# Altium project TermWylPompy1.PrjPcb
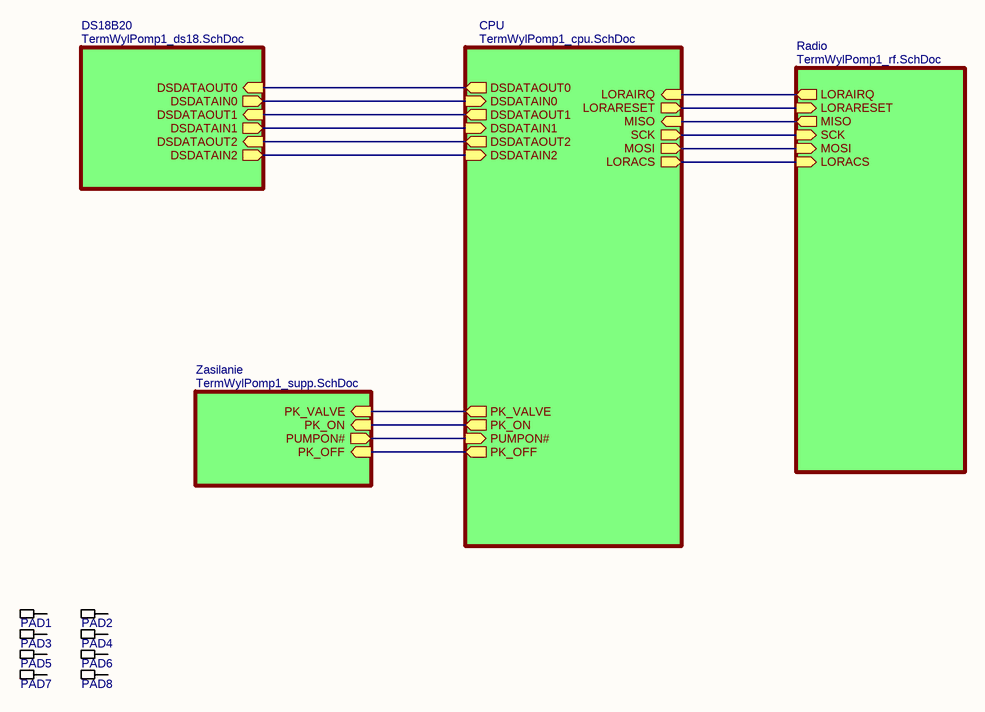
[diagram p0: TermWylPompy1_main.SchDoc]
NazwaProjektu: Wyłącznik termiczny pompy ogrodowej
5 sheets, 150 parts. Net scope: hierarchical (ports join the sheet entries above them; power ports are global).
Board file: TermWylPompy1.PcbDoc
Sheets:
  TermWylPompy1_main.SchDoc
    CPU = TermWylPomp1_cpu.SchDoc
    DS18B20 = TermWylPomp1_ds18.SchDoc
    Zasilanie = TermWylPomp1_supp.SchDoc
    Radio = TermWylPomp1_rf.SchDoc

## Sheet TermWylPompy1_main.SchDoc
size A4; LotOfPieces: 1

### Parts
PAD1  PAD3_5MM  [PAD3_5MM]  (value not drawn)  (no BOM)
PAD2  PAD3_5MM  [PAD3_5MM]  (value not drawn)  (no BOM)
PAD3  PAD3_5MM  [PAD3_5MM]  (value not drawn)  (no BOM)
PAD4  PAD3_5MM  [PAD3_5MM]  (value not drawn)  (no BOM)
PAD5  PAD3_5MM  [PAD3_5MM]  (value not drawn)  (no BOM)
PAD6  PAD3_5MM  [PAD3_5MM]  (value not drawn)  (no BOM)
PAD7  PAD3_5MM  [PAD3_5MM]  (value not drawn)  (no BOM)
PAD8  PAD3_5MM  [PAD3_5MM]  (value not drawn)  (no BOM)

### Sub-sheets
CPU = TermWylPomp1_cpu.SchDoc: DSDATAIN1 (in), DSDATAOUT0 (out), DSDATAOUT1 (out), DSDATAIN0 (in), PUMPON# (in), PK_OFF (out), DSDATAOUT2 (out), DSDATAIN2 (in), LORAIRQ (in), LORARESET (out), MISO (in), SCK (out), MOSI (out), LORACS (out), PK_ON (out), PK_VALVE (out)
DS18B20 = TermWylPomp1_ds18.SchDoc: DSDATAIN1 (out), DSDATAOUT0 (in), DSDATAOUT1 (in), DSDATAIN0 (out), DSDATAOUT2 (in), DSDATAIN2 (out)
Radio = TermWylPomp1_rf.SchDoc: LORAIRQ (out), LORARESET (in), MISO (out), SCK (in), MOSI (in), LORACS (in)
Zasilanie = TermWylPomp1_supp.SchDoc: PUMPON# (out), PK_OFF (in), PK_ON (in), PK_VALVE (in)

### Nets
DSDATAIN0: sheet CPU/DSDATAIN0, sheet DS18B20/DSDATAIN0
DSDATAIN1: sheet CPU/DSDATAIN1, sheet DS18B20/DSDATAIN1
DSDATAIN2: sheet CPU/DSDATAIN2, sheet DS18B20/DSDATAIN2
DSDATAOUT0: sheet CPU/DSDATAOUT0, sheet DS18B20/DSDATAOUT0
DSDATAOUT1: sheet CPU/DSDATAOUT1, sheet DS18B20/DSDATAOUT1
DSDATAOUT2: sheet CPU/DSDATAOUT2, sheet DS18B20/DSDATAOUT2
LORACS: sheet CPU/LORACS, sheet Radio/LORACS
LORAIRQ: sheet CPU/LORAIRQ, sheet Radio/LORAIRQ
LORARESET: sheet CPU/LORARESET, sheet Radio/LORARESET
MISO: sheet CPU/MISO, sheet Radio/MISO
MOSI: sheet CPU/MOSI, sheet Radio/MOSI
PK_OFF: sheet CPU/PK_OFF, sheet Zasilanie/PK_OFF
PK_ON: sheet CPU/PK_ON, sheet Zasilanie/PK_ON
PK_VALVE: sheet CPU/PK_VALVE, sheet Zasilanie/PK_VALVE
PUMPON#: sheet CPU/PUMPON#, sheet Zasilanie/PUMPON#
SCK: sheet CPU/SCK, sheet Radio/SCK

Not connected (* = marked no-connect by the designer): PAD1 1; PAD2 1; PAD3 1; PAD4 1; PAD5 1; PAD6 1; PAD7 1; PAD8 1

### Notes on the sheet
- Wariant:
- Rev.
- /
- Projekt i wykonanie: (C) Miroslaw Lach MRQ, www.mlach.com
- git:
- Page:
- Plik:

### Library data of the parts
PAD1-PAD8 = Oth106: PartIdx: Oth106; Identyfikator: 106; Descript: bd; Value: PAD3_5MM; DateOfPrice5: 2010-01-01; Price5: -1; Supplier5: bd; Manufacturer5: bd; Reference5: bd; Typ5: bd; ID: 106

## Sheet TermWylPomp1_cpu.SchDoc
size A3; Subtitle1: Mikrokontroler; LotOfPieces: 1
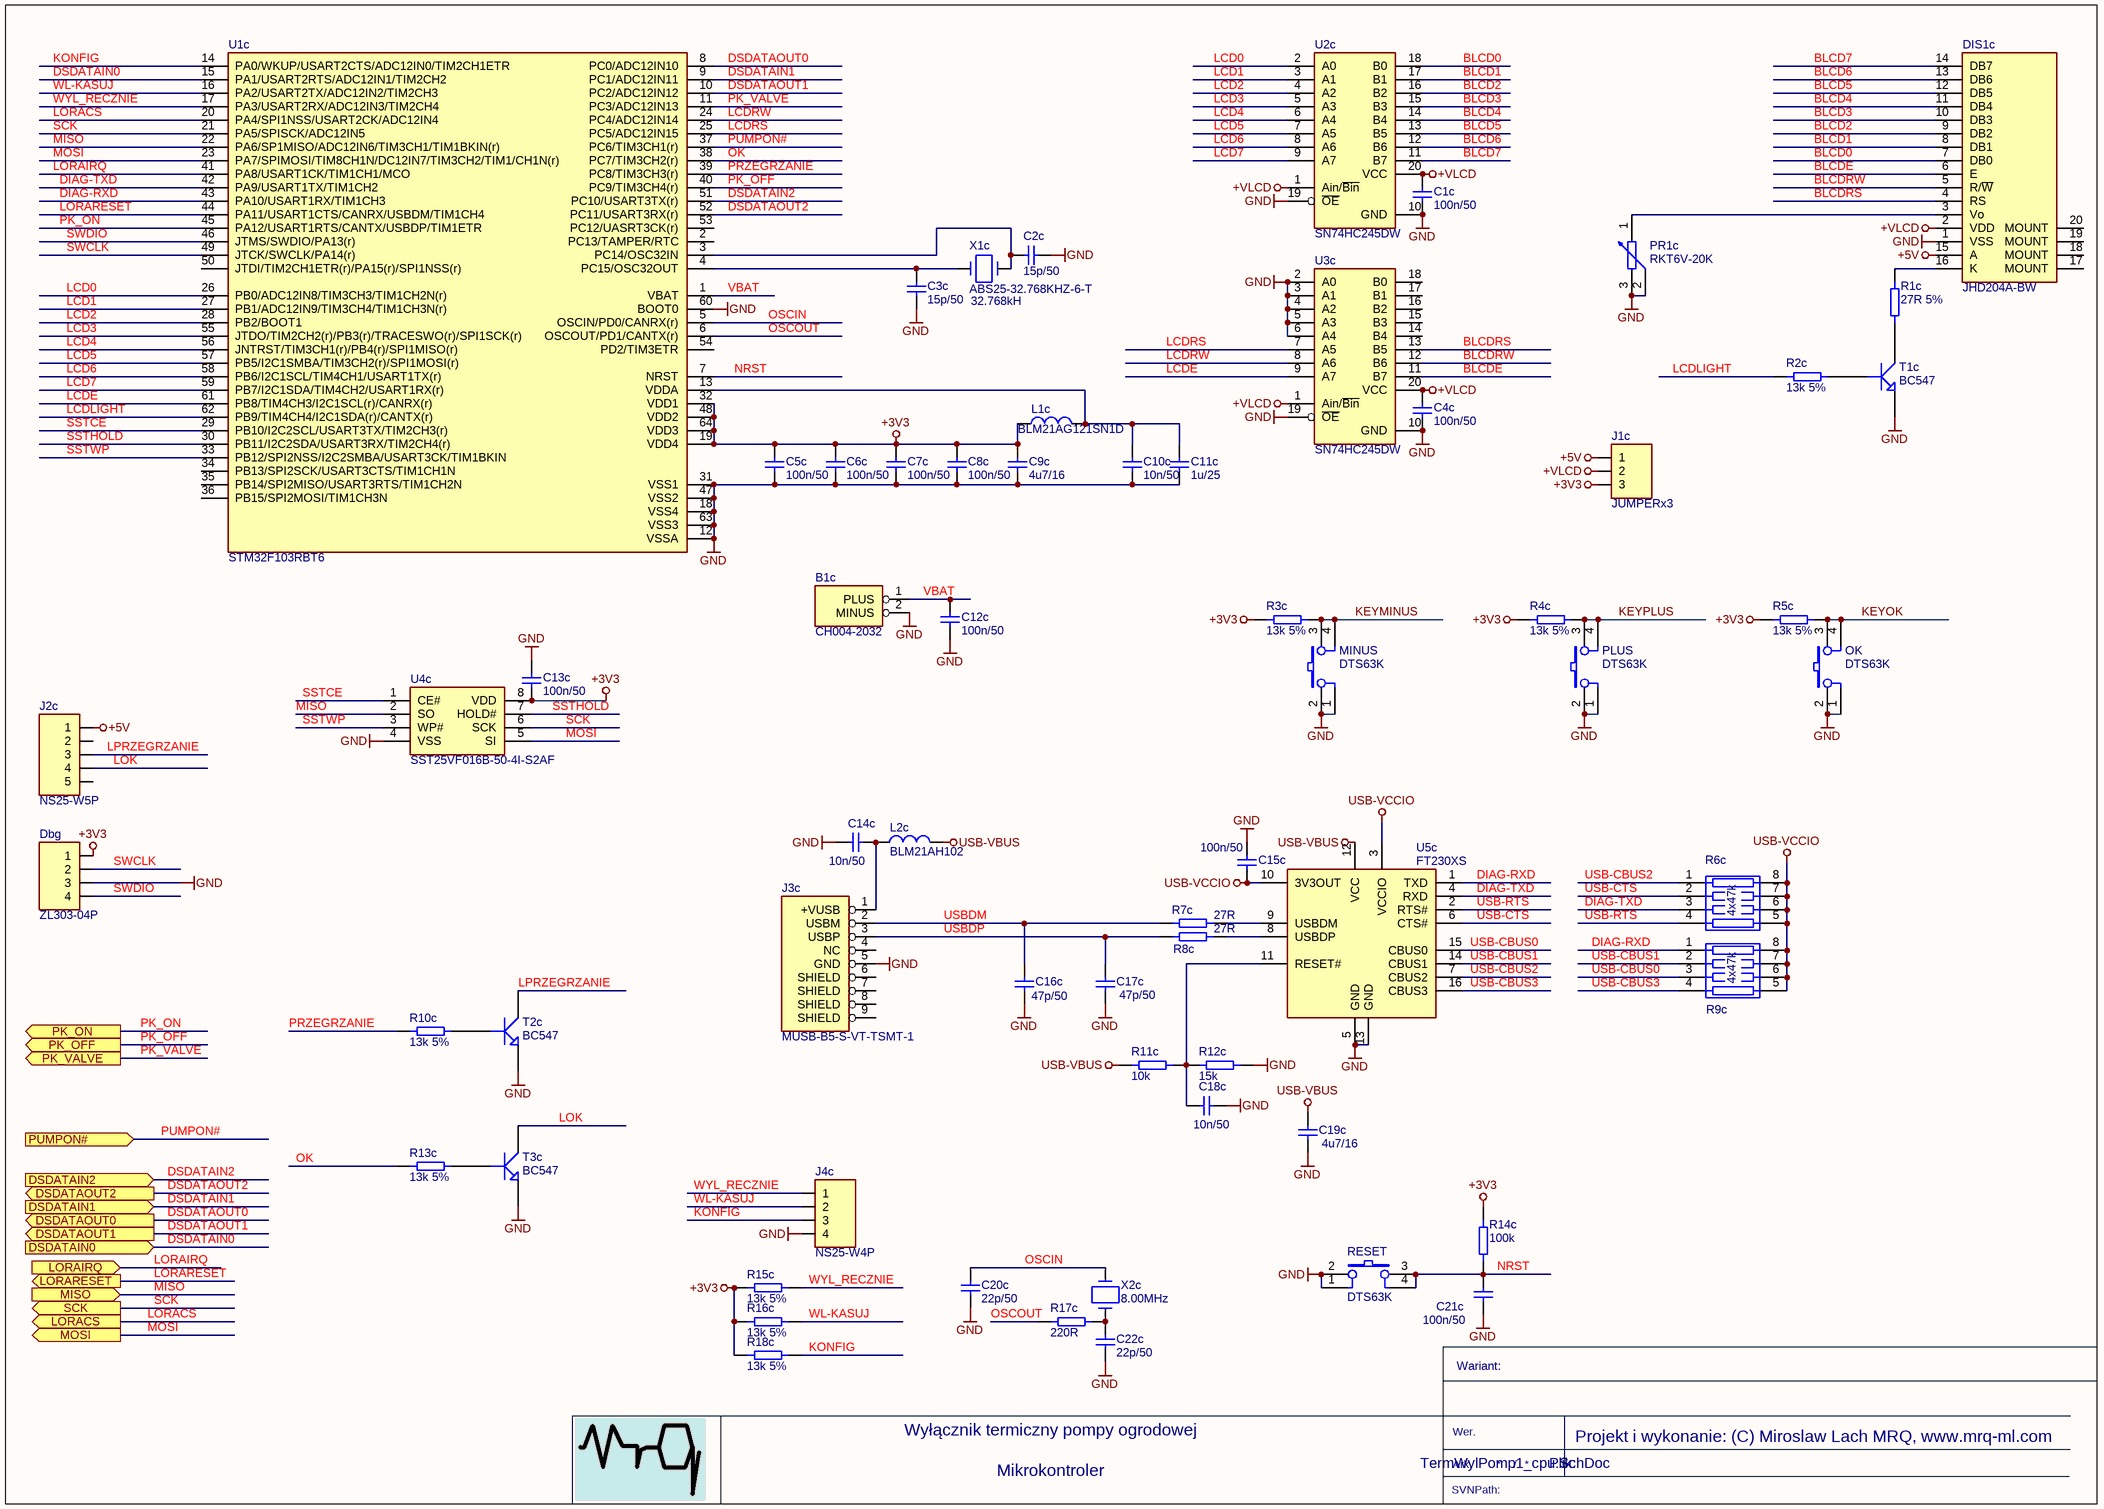
[diagram p1: TermWylPomp1_cpu.SchDoc]

### Parts
B1c  CH004-2032  [CH004-2032]
C1c  100n/50  [0805]
C2c  15p/50  [0603-IPC]
C3c  15p/50  [0603-IPC]
C4c  100n/50  [0805]
C5c  100n/50  [0805]
C6c  100n/50  [0805]
C7c  100n/50  [0805]
C8c  100n/50  [0805]
C9c  4u7/16  [0805]
C10c  10n/50  [0805]
C11c  1u/25  [0805]
C12c  100n/50  [0805]
C13c  100n/50  [0805]
C14c  10n/50  [0805]
C15c  100n/50  [0805]
C16c  47p/50  [0603-IPC]
C17c  47p/50  [0603-IPC]
C18c  10n/50  [0805]
C19c  4u7/16  [0805]
C20c  22p/50  [0805]
C21c  100n/50  [0805]
C22c  22p/50  [0805]
Dbg  ZL303-04P  [PLMS4S]
DIS1c  JHD204A-BW  [JHD204A]
J1c  JUMPERx3  [3SIP100]
J2c  NS25-W5P  [WF05S]
J3c  MUSB-B5-S-VT-TSMT-1  [MUSB-B5-S-VT-TSMT1]
J4c  NS25-W4P  [WF04S]
L1c  BLM21AG121SN1D  [0805]
L2c  BLM21AH102  [0805]
MINUS  DTS63K  [DTS63K]
OK  DTS63K  [DTS63K]
PLUS  DTS63K  [DTS63K]
PR1c  RKT6V-20K  [RKT6V]
R1c  27R 5%  [R402510]
R2c  13k 5%  [R402510]
R3c  13k 5%  [R402510]
R4c  13k 5%  [R402510]
R5c  13k 5%  [R402510]
R6c  4x47k  [1206RP]
R7c  27R  [0603R]
R8c  27R  [0603R]
R9c  4x47k  [1206RP]
R10c  13k 5%  [R402510]
R11c  10k  [0805R]
R12c  15k  [0805R]
R13c  13k 5%  [R402510]
R14c  100k  [R402510]
R15c  13k 5%  [R402510]
R16c  13k 5%  [R402510]
R17c  220R  [0805R]
R18c  13k 5%  [R402510]
RESET  DTS63K  [DTS63K]
T1c  BC547  [CE35V4]
T2c  BC547  [CE35V4]
T3c  BC547  [CE35V4]
U1c  STM32F103RBT6  [MS-026BCD]
U2c  SN74HC245DW  [20SOIC300]
U3c  SN74HC245DW  [20SOIC300]
U4c  SST25VF016B-50-4I-S2AF  [8SOIC200]
U5c  FT230XS  [MO-137AB]
X1c  ABS25-32.768KHZ-6-T  Freq: 32.768kH  [ABS25CRYSTAL]
X2c  8.00MHz  [HC49SMP]

### Ports
DSDATAIN0 (in), DSDATAIN1 (in), DSDATAIN2 (in), DSDATAOUT0 (out), DSDATAOUT1 (out), DSDATAOUT2 (out), LORACS (out), LORAIRQ (in), LORARESET (out), MISO (in), MOSI (out), PK_OFF (out), PK_ON (out), PK_VALVE (out), PUMPON# (in), SCK (out)

### Nets
+3V3: C5c.1 C6c.1 C7c.1 C8c.1 C9c.1 C13c.1 Dbg.1 J1c.3 L1c.1 R3c.1 R4c.1 R5c.1 R14c.1 R15c.1 R16c.2 R18c.1 U1c.19(VDD4) U1c.32(VDD1) U1c.48(VDD2) U1c.64(VDD3) U4c.8(VDD)
+5V: DIS1c.15(A) J1c.1 J2c.1
+VLCD: C1c.1 C4c.1 DIS1c.2(VDD) J1c.2 U2c.1(Ain/~{Bin}) U2c.20(VCC) U3c.1(Ain/~{Bin}) U3c.20(VCC)
GND: B1c.2(MINUS) C1c.2 C2c.1 C3c.1 C4c.2 C5c.2 C6c.2 C7c.2 C8c.2 C9c.2 C10c.2 C11c.2 C12c.2 C13c.2 C14c.1 C15c.1 C16c.2 C17c.2 C18c.1 C19c.2 C20c.1 C21c.2 C22c.1 Dbg.3 DIS1c.1(VSS) J3c.5(GND) J4c.4 MINUS.1 MINUS.2 OK.1 OK.2 PLUS.1 PLUS.2 PR1c.2 PR1c.3 R12c.2 RESET.1 RESET.2 T1c.EMIT T2c.EMIT T3c.EMIT U1c.12(VSSA) U1c.18(VSS4) U1c.31(VSS1) U1c.47(VSS2) U1c.60(BOOT0) U1c.63(VSS3) U2c.10(GND) U2c.19(~{OE}) U3c.2(A0) U3c.3(A1) U3c.4(A2) U3c.5(A3) U3c.6(A4) U3c.10(GND) U3c.19(~{OE}) U4c.4(VSS) U5c.5(GND) U5c.13(GND)
USB-VBUS: C19c.1 L2c.2 R11c.1 U5c.12(VCC)
USB-VCCIO: C15c.2 R6c.5(R5) R6c.6(R6) R6c.7(R7) R6c.8(R8) R9c.5(R5) R9c.6(R6) R9c.7(R7) R9c.8(R8) U5c.3(VCCIO) U5c.10(3V3OUT)
BLCD0: DIS1c.7(DB0) U2c.18(B0)
BLCD1: DIS1c.8(DB1) U2c.17(B1)
BLCD2: DIS1c.9(DB2) U2c.16(B2)
BLCD3: DIS1c.10(DB3) U2c.15(B3)
BLCD4: DIS1c.11(DB4) U2c.14(B4)
BLCD5: DIS1c.12(DB5) U2c.13(B5)
BLCD6: DIS1c.13(DB6) U2c.12(B6)
BLCD7: DIS1c.14(DB7) U2c.11(B7)
BLCDE: DIS1c.6(E) U3c.11(B7)
BLCDRS: DIS1c.4(RS) U3c.13(B5)
BLCDRW: DIS1c.5(R/~{W}) U3c.12(B6)
DIAG-RXD: R9c.1(R1) U1c.43(PA10/USART1RX/TIM1CH3) U5c.1(TXD)
DIAG-TXD: R6c.3(R3) U1c.42(PA9/USART1TX/TIM1CH2) U5c.4(RXD)
DSDATAIN0: U1c.15(PA1/USART2RTS/ADC12IN1/TIM2CH2) ; port DSDATAIN0
DSDATAIN1: U1c.9(PC1/ADC12IN11) ; port DSDATAIN1
DSDATAIN2: U1c.51(PC10/USART3TX(r)) ; port DSDATAIN2
DSDATAOUT0: U1c.8(PC0/ADC12IN10) ; port DSDATAOUT0
DSDATAOUT1: U1c.10(PC2/ADC12IN12) ; port DSDATAOUT1
DSDATAOUT2: U1c.52(PC11/USART3RX(r)) ; port DSDATAOUT2
KEYMINUS: MINUS.3 MINUS.4 R3c.2
KEYOK: OK.3 OK.4 R5c.2
KEYPLUS: PLUS.3 PLUS.4 R4c.2
KONFIG: J4c.3 R18c.2 U1c.14(PA0/WKUP/USART2CTS/ADC12IN0/TIM2CH1ETR)
LCD0: U1c.26(PB0/ADC12IN8/TIM3CH3/TIM1CH2N(r)) U2c.2(A0)
LCD1: U1c.27(PB1/ADC12IN9/TIM3CH4/TIM1CH3N(r)) U2c.3(A1)
LCD2: U1c.28(PB2/BOOT1) U2c.4(A2)
LCD3: U1c.55(JTDO/TIM2CH2(r)/PB3(r)/TRACESWO(r)/SPI1SCK(r)) U2c.5(A3)
LCD4: U1c.56(JNTRST/TIM3CH1(r)/PB4(r)/SPI1MISO(r)) U2c.6(A4)
LCD5: U1c.57(PB5/I2C1SMBA/TIM3CH2(r)/SPI1MOSI(r)) U2c.7(A5)
LCD6: U1c.58(PB6/I2C1SCL/TIM4CH1/USART1TX(r)) U2c.8(A6)
LCD7: U1c.59(PB7/I2C1SDA/TIM4CH2/USART1RX(r)) U2c.9(A7)
LCDE: U1c.61(PB8/TIM4CH3/I2C1SCL(r)/CANRX(r)) U3c.9(A7)
LCDLIGHT: R2c.1 U1c.62(PB9/TIM4CH4/I2C1SDA(r)/CANTX(r))
LCDRS: U1c.25(PC5/ADC12IN15) U3c.7(A5)
LCDRW: U1c.24(PC4/ADC12IN14) U3c.8(A6)
LOK: J2c.4 T3c.COLL
LORACS: U1c.20(PA4/SPI1NSS/USART2CK/ADC12IN4) ; port LORACS
LORAIRQ: U1c.41(PA8/USART1CK/TIM1CH1/MCO) ; port LORAIRQ
LORARESET: U1c.44(PA11/USART1CTS/CANRX/USBDM/TIM1CH4) ; port LORARESET
LPRZEGRZANIE: J2c.3 T2c.COLL
MISO: U1c.22(PA6/SP1MISO/ADC12IN6/TIM3CH1/TIM1BKIN(r)) U4c.2(SO) ; port MISO
MOSI: U1c.23(PA7/SPIMOSI/TIM8CH1N/DC12IN7/TIM3CH2/TIM1/CH1N(r)) U4c.5(SI) ; port MOSI
NRST: C21c.1 R14c.2 RESET.3 RESET.4 U1c.7(NRST)
OK: R13c.1 U1c.38(PC7/TIM3CH2(r))
OSCIN: C20c.2 U1c.5(OSCIN/PD0/CANRX(r)) X2c.2
OSCOUT: R17c.1 U1c.6(OSCOUT/PD1/CANTX(r))
PK_OFF: U1c.40(PC9/TIM3CH4(r)) ; port PK_OFF
PK_ON: U1c.45(PA12/USART1RTS/CANTX/USBDP/TIM1ETR) ; port PK_ON
PK_VALVE: U1c.11(PC3/ADC12IN13) ; port PK_VALVE
PRZEGRZANIE: R10c.1 U1c.39(PC8/TIM3CH3(r))
PUMPON#: U1c.37(PC6/TIM3CH1(r)) ; port PUMPON#
SCK: U1c.21(PA5/SPISCK/ADC12IN5) U4c.6(SCK) ; port SCK
SSTCE: U1c.29(PB10/I2C2SCL/USART3TX/TIM2CH3(r)) U4c.1(CE#)
SSTHOLD: U1c.30(PB11/I2C2SDA/USART3RX/TIM2CH4(r)) U4c.7(HOLD#)
SSTWP: U1c.33(PB12/SPI2NSS/I2C2SMBA/USART3CK/TIM1BKIN) U4c.3(WP#)
SWCLK: Dbg.2 U1c.49(JTCK/SWCLK/PA14(r))
SWDIO: Dbg.4 U1c.46(JTMS/SWDIO/PA13(r))
USB-CBUS0: R9c.3(R3) U5c.15(CBUS0)
USB-CBUS1: R9c.2(R2) U5c.14(CBUS1)
USB-CBUS2: R6c.1(R1) U5c.7(CBUS2)
USB-CBUS3: R9c.4(R4) U5c.16(CBUS3)
USB-CTS: R6c.2(R2) U5c.6(CTS#)
USB-RTS: R6c.4(R4) U5c.2(RTS#)
USBDM: C16c.1 J3c.2(USBM) R7c.1
USBDP: C17c.1 J3c.3(USBP) R8c.1
VBAT: B1c.1(PLUS) C12c.1 U1c.1(VBAT)
WL-KASUJ: J4c.2 R16c.1 U1c.16(PA2/USART2TX/ADC12IN2/TIM2CH3)
WYL_RECZNIE: J4c.1 R15c.2 U1c.17(PA3/USART2RX/ADC12IN3/TIM2CH4)
NetC2c_2: C2c.2 U1c.3(PC14/OSC32IN) X1c.1
NetC3c_2: C3c.2 U1c.4(PC15/OSC32OUT) X1c.2
NetC10c_1: C10c.1 C11c.1 L1c.2 U1c.13(VDDA)
NetC14c_2: C14c.2 J3c.1(+VUSB) L2c.1
NetC18c_2: C18c.2 R11c.2 R12c.1 U5c.11(RESET#)
NetC22c_2: C22c.2 R17c.2 X2c.1
NetDIS1c_3: DIS1c.3(Vo) PR1c.1
NetDIS1c_16: DIS1c.16(K) R1c.1
NetR1c_2: R1c.2 T1c.COLL
NetR2c_2: R2c.2 T1c.BASE
NetR7c_2: R7c.2 U5c.9(USBDM)
NetR8c_2: R8c.2 U5c.8(USBDP)
NetR10c_2: R10c.2 T2c.BASE
NetR13c_2: R13c.2 T3c.BASE

Not connected (* = marked no-connect by the designer): DIS1c 17(MOUNT) 18(MOUNT) 19(MOUNT) 20(MOUNT); J2c 2 5; J3c 4(NC) 6(SHIELD) 7(SHIELD) 8(SHIELD) 9(SHIELD); U1c 2(PC13/TAMPER/RTC) 34(PB13/SPI2SCK/USART3CTS/TIM1CH1N) 35(PB14/SPI2MISO/USART3RTS/TIM1CH2N) 36(PB15/SPI2MOSI/TIM1CH3N) 50(JTDI/TIM2CH1ETR(r)/PA15(r)/SPI1NSS(r)) 53(PC12/UASRT3CK(r)) 54(PD2/TIM3ETR); U3c 14(B4) 15(B3) 16(B2) 17(B1) 18(B0)

### Notes on the sheet
- Wariant:
- Ark.
- Wer.
- /
- Plik:
- Projekt i wykonanie: (C) Miroslaw Lach MRQ, www.mrq-ml.com
- SVNPath:

### Library data of the parts
B1c = Con27: Descript: Battery holder for CR2032; Kod: Con27; ID: 27; Replacement: bd; Value: CH004-2032; Supplier5: tme.pl; Reference5: CH004-2032; Manufacturer5: COMF; Typ5: CH004-2032; Price5: 2; DateOfPrice5: 2010-01-01
C1c C4c C5c C6c C7c C8c C12c C13c C15c C21c = CAP7: Descript: Kondensator: ceramiczny; MLCC; 100nF; 50V; X7R; ±10%; SMD; 0805; Reference5: CL21B104KBCNNNC; Kod: CAP7; ID: 7; Value: 100n/50; Supplier5: tme.pl; Manufacturer5: Samsung; Typ5: CL21B104KBCNNNC; Price5: 0; DateOfPrice5: 2010-01-01
C2c C3c = CAP126: Descript: Kondensator: ceramiczny; MLCC; 15pF; 50V; C0G; ±5%; SMD; 0603; Reference5: CL10C150JB8NNNC; Kod: CAP126; ID: 126; Value: 15p/50; Supplier5: tme.pl; Manufacturer5: Samsung; Typ5: CL10C150JB8NNNC; Price5: 0; DateOfPrice5: 2010-01-01
C9c C19c = CAP97: Descript: Kondensator: ceramiczny; MLCC; 4,7uF; 16VDC; X7R; ±5%; SMD; 0805; Reference5: C0805C475J4RACAUTO; Kod: CAP97; ID: 97; Value: 4u7/16; Supplier5: tme.pl; Manufacturer5: Kemet; Typ5: C0805C475J4RACAUTO; Price5: 1,5; DateOfPrice5: 2020-05-10
C10c C14c C18c = CAP21: Descript: Kondensator: ceramiczny; MLCC; 10nF; 50V; X7R; ±10%; SMD; 0805; Reference5: CL21B103KBANNNC; Kod: CAP21; ID: 21; Value: 10n/50; Supplier5: tme.pl; Manufacturer5: Samsung; Typ5: CL21B103KBANNNC; Price5: 0; DateOfPrice5: 2010-01-01
C11c = CAP38: Descript: Kondensator: ceramiczny; MLCC; 1uF; 25V; X7R; ±10%; SMD; 0805; Reference5: CL21B105KAFNNN; Kod: CAP38; ID: 38; Value: 1u/25; Supplier5: tme.pl; Manufacturer5: Samsung; Typ5: CL21B105KAFNNN; Price5: 0; DateOfPrice5: 2010-01-01
C16c C17c = CAP85: Descript: Kondensator: ceramiczny; MLCC; 47pF; 50V; C0G; ±5%; SMD; 0603; Reference5: CC0603JRNPO9470; Typ5: CC0603JRNPO9BN470; Kod: CAP85; ID: 85; Value: 47p/50; Supplier5: tme.pl; Manufacturer5: Yageo; Price5: 0,08; DateOfPrice5: 2020-05-10
C20c C22c = CAP54: Descript: Kondensator: ceramiczny; MLCC; 22pF; 50V; C0G; ±5%; SMD; 0805; Reference5: CL21C220JBANNNC; Kod: CAP54; ID: 54; Value: 22p/50; Supplier5: tme.pl; Manufacturer5: Samsung; Typ5: CL21C220JBANNNC; Price5: 0,12; DateOfPrice5: 2020-05-10
Dbg = Con298: Descript: Listwa kołkowa; kołkowe; męskie; PIN:4; proste; 2mm; THT; 1x4; Replacement: bd; Kod: Con298; ID: 298; Value: ZL303-04P; Supplier5: tme.pl; Reference5: ZL303-04P; Price5: 0,2; DateOfPrice5: 2020-05-10; Manufacturer5: Ninigi; Typ5: ZL303-04P
DIS1c = Opt46: Kod: Opt46; ID: 46; Descript: Wyświetlacz LCD 4x20 znaków niebieski; Reference5: LCD-01015; Value: JHD204A-BW; Price5: 26; DateOfPrice5: 2020-07-24; Supplier5: Botland; Manufacturer5: JHD; Typ5: JHD204A-BW
J1c = Con59: Kod: Con59; ID: 59; Descript: Listwa kołkowa; kołkowe; męskie; PIN: 3; proste; 2,54mm; THT; 1x3; Reference5: ZL201-03G; Replacement: bd; Value: JUMPERx3; Price5: 0; DateOfPrice5: 2010-01-01; Supplier5: tme
J2c = Con109: Descript: Gniazdo; przewód-płytka; męskie; PIN:5; 2,54mm; THT; NS25; 250V; 3A; Replacement: maritex: WF05S; Kod: Con109; ID: 109; Value: NS25-W5P; Reference5: NS25-W5P; Supplier5: tme.pl; Manufacturer5: ninigi; Price5: 0; Typ5: NS25-W5P; DateOfPrice5: 2010-01-01
J3c = Con92: Descript: Gniazdo; USB B mini; SMT; pionowe; V: USB 2.0; złocony; Kod: Con92; ID: 92; Replacement: bd; Value: MUSB-B5-S-VT-TSMT-1; Supplier5: tme.pl; Reference5: MUSB-B5-S-VT-TSMT1; Manufacturer5: AdamTech; Typ5: MUSB-B5-S-VT-TSMT-1; Price5: 2; DateOfPrice5: 2010-01-01
J4c = Con107: Descript: Gniazdo; przewód-płytka; męskie; PIN:4; 2,54mm; THT; NS25; 250V; 3A; Replacement: maritex: WF04S; Kod: Con107; ID: 107; Value: NS25-W4P; Reference5: NS25-W4P; Supplier5: tme.pl; Manufacturer5: ninigi; Price5: 0; Typ5: NS25-W4P; DateOfPrice5: 2010-01-01
L1c = Ind42: Descript: Chip inductor SMD, 0805, Imax=0.2A,Z=120ohm, Rdc=0.15ohm; Kod: Ind42; ID: 42; Value: BLM21AG121SN1D; Supplier5: tme.pl; Reference5: BLM21AG121SN1D; Price5: 0; DateOfPrice5: 2010-01-01; InductCurr: -; Manufacturer5: -; Typ5: -
L2c = Ind43: Descript: Ferryt: koralik; Imp.@ 100MHz:1000Ω; Montaż: SMD; 200mA; Obud:0805; Reference5: BLM21AH102SN1D; Kod: Ind43; ID: 43; Value: BLM21AH102; Supplier5: tme.pl; Price5: 0; DateOfPrice5: 2010-01-01; Manufacturer5: Murata; Typ5: BLM21AH102SN1D; InductCurr: -
MINUS OK PLUS RESET = Elm16: Descript: Mikroprzełącznik TACT; SPST-NO; Pozycje: 2; 0,05A/12VDC; THT; brak; Typ5: DTS-63K; Kod: Elm16; ID: 16; Value: DTS63K; Supplier5: tme.pl; Reference5: DTS63K; Manufacturer5: Diptronics; Price5: 1; DateOfPrice5: 2010-01-01
PR1c = Vre33: Kod: Vre33; ID: 33; Descript: Potencjometr: montażowy, jednoobrotowy, stojący; 20kΩ; 100mW; ±30%; Value: RKT6V-20K; Price5: 0; DateOfPrice5: 2010-01-01; Supplier5: tme.pl; Reference5: RKT6V-20K; Manufacturer5: SR Passives; Typ5: RKT6V-20K
R1c = Res347: Kod: Res347; ID: 347; Descript: Rezystor: węglowy; THT; 27Ω; 0,25W; ±5%; Ø2,5x6,8mm; osiowe; Reference5: 1/4W27R; Typ5: CFR0W4J0270A50; Value: 27R 5%; Price5: 0,1; DateOfPrice5: 2020-07-29 18:38:04; Supplier5: tme.pl; Manufacturer5: Royal Ohm
R2c = Res66: Kod: Res66; ID: 66; Descript: Rezystor: węglowy; THT; 13kΩ; 0,25W; ±5%; Ø2,5x6,8mm; osiowe; Reference5: ML0.25W-13K-5%; Typ5: CFR0W4J0133A50; Value: 13k 5%; Price5: 0,06; DateOfPrice5: 2020-07-26 12:26:58; Supplier5: mrq; Manufacturer5: Royal Ohm
R3c R4c R5c R10c R13c R15c R16c R18c = Res66: Descript: Rezystor: węglowy; THT; 13kΩ; 0,25W; ±5%; Ø2,5x6,8mm; osiowe; Reference5: ML0.25W-13K-5%; Typ5: CFR0W4J0133A50; Kod: Res66; ID: 66; Value: 13k 5%; Supplier5: mrq; Manufacturer5: Royal Ohm; Price5: 0,06; DateOfPrice5: 2020-07-26 12:26:58
R6c R9c = Res182: Descript: Drabinka rezystorowa: Y; 47kΩ; SMD; 1206; Il.rezystorów:4; 63mW; Reference5: DR1206-47K-4/8; Typ5: 4D03WGJ0473T; Kod: Res182; ID: 182; Value: 4x47k; Supplier5: tme.pl; Manufacturer5: Royal Ohm; Price5: 0,1; DateOfPrice5: 2020-05-10
R7c R8c = Res106: Descript: Rezystor: thick film; SMD; 0603; 27Ω; 0,1W; ±1%; -55÷125°C; Reference5: SMD0603-27R-1%; Typ5: 0603SAF270JT5E; Kod: Res106; ID: 106; Value: 27R; Supplier5: tme.pl; Manufacturer5: Royal Ohm; Price5: 0,1; DateOfPrice5: 2020-05-10
R11c = Res16: Descript: Rezystor: thick film; SMD; 0805; 10kom; 0,125W; ±1%; -55÷125°C; Reference5: SMD0805-10K-1%; Typ5: 0805S8F1002T5E; Kod: Res16; ID: 16; Value: 10k; Supplier5: tme.pl; Manufacturer5: Royal Ohm; Price5: 0,1; DateOfPrice5: 2020-06-25 12:16:54
R12c = Res40: Descript: Rezystor: thick film; SMD; 0805; 15kΩ; 0,125W; ±1%; -55÷125°C; Reference5: SMD0805-15K-1%; Typ5: 0805WAF 15K T5E; Kod: Res40; ID: 40; Value: 15k; Supplier5: tme.pl; Manufacturer5: Royal Ohm; Price5: 0,1; DateOfPrice5: 2020-06-25 12:16:54
R14c = Res11: Descript: Rezystor: metal film; THT; 100kohm; 0,6W; ±1%; Ø2,5x6,8mm; 50ppm/°C; Reference5: M0.6W-100K; Typ5: MF006FF1003A50; Kod: Res11; ID: 11; Value: 100k; Supplier5: tme.pl; Manufacturer5: Royal Ohm; Price5: 0,1; DateOfPrice5: 2020-06-25 12:16:54
R17c = Res88: Descript: Rezystor: thick film; SMD; 0805; 220Ω; 0,125W; ±1%; -55÷125°C; Reference5: SMD0805-220R-1%; Typ5: 0805S8F2200T5E; Kod: Res88; ID: 88; Value: 220R; Supplier5: tme.pl; Manufacturer5: Royal Ohm; Price5: 0,08; DateOfPrice5: 2020-05-10
T1c = Tra9: Kod: Tra9; ID: 9; Descript: Tranzystor: NPN; bipolarny; 50V; 100mA; 500mW; TO92; Reference5: BC547A; Value: BC547; Price5: 0,1; DateOfPrice5: 2010-01-01; Supplier5: tme.pl; Manufacturer5: Diotec; Typ5: BC547A
T2c T3c = Tra9: Descript: Tranzystor: NPN; bipolarny; 50V; 100mA; 500mW; TO92; Reference5: BC547A; Kod: Tra9; ID: 9; Value: BC547; Supplier5: tme.pl; Manufacturer5: Diotec; Price5: 0,1; Typ5: BC547A; DateOfPrice5: 2010-01-01
U1c = ICs273: Descript: ARM Cortex-M3 CPU, 128kB Flash, 20kB RAM, USB, CAN, 3xUART, 2xI2C, 2xSPI, ADC, DAC, STM, LQFP64; Kod: ICs273; ID: 273; Value: STM32F103RBT6; Supplier5: tme.pl; Reference5: STM32F103RBT6; Manufacturer5: ST; Typ5: STM32F103RBT6; Price5: 17; DateOfPrice5: 2010-01-01
U2c U3c = ICs123: Kod: ICs123; ID: 123; Descript: IC: cyfrowy; 3-state, bus transceiver; Kanały:8; SO20; 2÷6VDC; Value: SN74HC245DW; Price5: 0,1; DateOfPrice5: 2020-07-29 18:58:11; Supplier5: tme.pl; Reference5: SN74HC245DW; Manufacturer5: TI; Typ5: SN74HC245DW
U4c = ICs252: Kod: ICs252; ID: 252; Descript: Pamięć: Serial Flash; SPI; 80MHz; 2,7÷3,6V; SO8-W; Reference5: SST25016B-504IS; Value: SST25VF016B-50-4I-S2AF; Price5: 6; DateOfPrice5: 2010-01-01; Supplier5: tme.pl; Manufacturer5: Microchip; Typ5: SST25VF016B-50-4I-S2AF
U5c = ICs109: Descript: Interfejs; USB-basic UART; Ilość pinów CBUS:4; tuba; SSOP16; Reference5: FT230XS-R; Kod: ICs109; ID: 109; Value: FT230XS; Supplier5: tme.pl; Manufacturer5: FTDI; Typ5: FT230XS-R; Price5: 8,8; DateOfPrice5: 2020-05-10
X1c = Qua9: Descript: 32.768kHz crystal; Kod: Qua9; ID: 9; Value: ABS25-32.768KHZ-6-T; Supplier5: tme.pl; Reference5: ABS25-32.768KHZ-6; Price5: 3; DateOfPrice5: 2010-01-01; Manufacturer5: Abracon; Typ5: ABS25-32.768KHZ-6-T
X2c = Qua16: Descript: Rezonator: kwarcowy; 8MHz; ±30ppm; 20pF; SMD; HC49SM; Reference5: 8.00M-SMDHC49S; Kod: Qua16; ID: 16; Value: 8.00MHz; Supplier5: tme.pl; Manufacturer5: YIC; Price5: 2; DateOfPrice5: 2020-05-10; Freq: -

## Sheet TermWylPomp1_ds18.SchDoc
size A4; LotOfPieces: 1
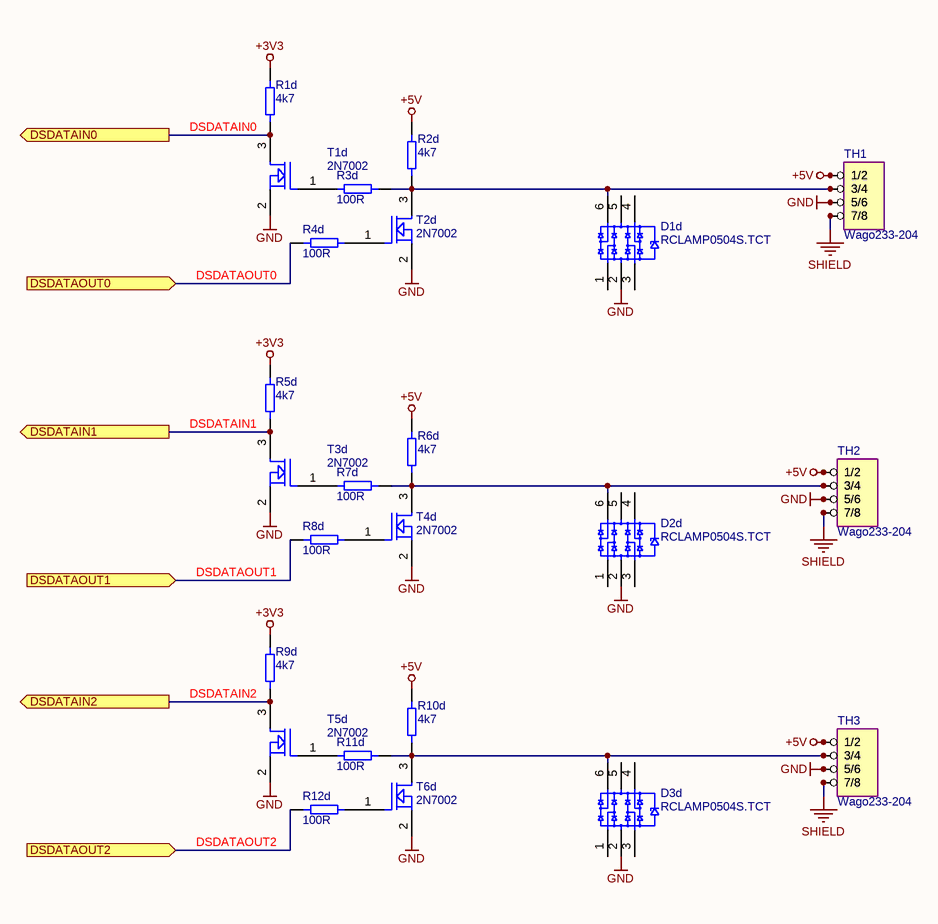
[diagram p2: TermWylPomp1_ds18.SchDoc]

### Parts
D1d  RCLAMP0504S.TCT  [SOT23-6]
D2d  RCLAMP0504S.TCT  [SOT23-6]
D3d  RCLAMP0504S.TCT  [SOT23-6]
R1d  4k7  [0805R]
R2d  4k7  [0805R]
R3d  100R  [0805R]
R4d  100R  [0805R]
R5d  4k7  [0805R]
R6d  4k7  [0805R]
R7d  100R  [0805R]
R8d  100R  [0805R]
R9d  4k7  [0805R]
R10d  4k7  [0805R]
R11d  100R  [0805R]
R12d  100R  [0805R]
T1d  2N7002  [SOT23-3]
T2d  2N7002  [SOT23-3]
T3d  2N7002  [SOT23-3]
T4d  2N7002  [SOT23-3]
T5d  2N7002  [SOT23-3]
T6d  2N7002  [SOT23-3]
TH1  Wago233-204  [Wago233-204]
TH2  Wago233-204  [Wago233-204]
TH3  Wago233-204  [Wago233-204]

### Ports
DSDATAIN0 (out), DSDATAIN1 (out), DSDATAIN2 (out), DSDATAOUT0 (in), DSDATAOUT1 (in), DSDATAOUT2 (in)

### Nets
+3V3: R1d.1 R5d.1 R9d.1
+5V: R2d.1 R6d.1 R10d.1 TH1.1(1/2) TH1.2(1/2) TH2.1(1/2) TH2.2(1/2) TH3.1(1/2) TH3.2(1/2)
GND: D1d.2 D2d.2 D3d.2 T1d.2(SOURCE) T2d.2(SOURCE) T3d.2(SOURCE) T4d.2(SOURCE) T5d.2(SOURCE) T6d.2(SOURCE) TH1.5(5/6) TH1.6(5/6) TH2.5(5/6) TH2.6(5/6) TH3.5(5/6) TH3.6(5/6)
SHIELD: TH1.7(7/8) TH1.8(7/8) TH2.7(7/8) TH2.8(7/8) TH3.7(7/8) TH3.8(7/8)
DSDATAIN0: R1d.2 T1d.3(DRAIN) ; port DSDATAIN0
DSDATAIN1: R5d.2 T3d.3(DRAIN) ; port DSDATAIN1
DSDATAIN2: R9d.2 T5d.3(DRAIN) ; port DSDATAIN2
DSDATAOUT0: R4d.1 ; port DSDATAOUT0
DSDATAOUT1: R8d.1 ; port DSDATAOUT1
DSDATAOUT2: R12d.1 ; port DSDATAOUT2
NetD1d_6: D1d.6 R2d.2 R3d.2 T2d.3(DRAIN) TH1.3(3/4) TH1.4(3/4)
NetD2d_6: D2d.6 R6d.2 R7d.2 T4d.3(DRAIN) TH2.3(3/4) TH2.4(3/4)
NetD3d_6: D3d.6 R10d.2 R11d.2 T6d.3(DRAIN) TH3.3(3/4) TH3.4(3/4)
NetR3d_1: R3d.1 T1d.1(GATE)
NetR4d_2: R4d.2 T2d.1(GATE)
NetR7d_1: R7d.1 T3d.1(GATE)
NetR8d_2: R8d.2 T4d.1(GATE)
NetR11d_1: R11d.1 T5d.1(GATE)
NetR12d_2: R12d.2 T6d.1(GATE)

Not connected (* = marked no-connect by the designer): D1d 1 3 4 5; D2d 1 3 4 5; D3d 1 3 4 5

### Notes on the sheet
- Wariant:
- Rev.
- /
- Projekt i wykonanie: (C) Miroslaw Lach MRQ, www.mlach.com
- git:
- Page:
- Plik:

### Library data of the parts
D1d D2d D3d = DIO7: Descript: Dioda: drabinka diodowa; 6V; 6A; jednokierunkowa; 150W; SOT23-6; Kod: DIO7; ID: 7; Value: RCLAMP0504S.TCT; Reference5: RCLAMP0504S.TCT; Supplier5: tme.pl; Manufacturer5: SEMTECH; Price5: 1; Typ5: RCLAMP0504S.TCT; DateOfPrice5: 2010-01-01
R1d R2d R5d R6d R9d R10d = Res172: Descript: Rezystor: thick film; SMD; 0805; 4,7kΩ; 0,125W; ±1%; -55÷125°C; Reference5: SMD0805-4K7-1%; Typ5: 0805S8F4701T5E; Kod: Res172; ID: 172; Value: 4k7; Supplier5: tme.pl; Manufacturer5: Royal Ohm; Price5: 0,1; DateOfPrice5: 2020-06-25 12:16:54
R3d R4d R7d R8d R11d R12d = Res13: Descript: Rezystor: thick film; SMD; 0805; 100om; 0,125W; ±1%; -55÷125°C; Reference5: SMD0805-100R-1%; Typ5: 0805S8F1000T5E; Kod: Res13; ID: 13; Value: 100R; Supplier5: tme.pl; Manufacturer5: Royal Ohm; Price5: 0,1; DateOfPrice5: 2020-06-25 12:16:54
T1d T2d T3d T4d T5d T6d = Tra2: Descript: Tranzystor: N-MOSFET; unipolarny; 60V; 800mA; 200mW; SOT23; Kod: Tra2; ID: 2; Value: 2N7002; Supplier5: tme.pl; Reference5: 2N7002; Price5: 0; DateOfPrice5: 2010-01-01; Manufacturer5: Fairchild; Typ5: 2N7002
TH1-TH3 = Con261: Descript: PCB terminal strip with push buttons 0.5mm2; Reference5: 112495; Kod: Con261; ID: 261; Replacement: bd; Value: Wago233-204; Supplier5: soselectronic.pl; Price5: 5; DateOfPrice5: 2010-01-01; Manufacturer5: Wago; Typ5: 233-204

## Sheet TermWylPomp1_supp.SchDoc
size A4; Subtitle0: Zasilacze; Subtitle1: i; Subtitle2: przekaźniki; LotOfPieces: 1
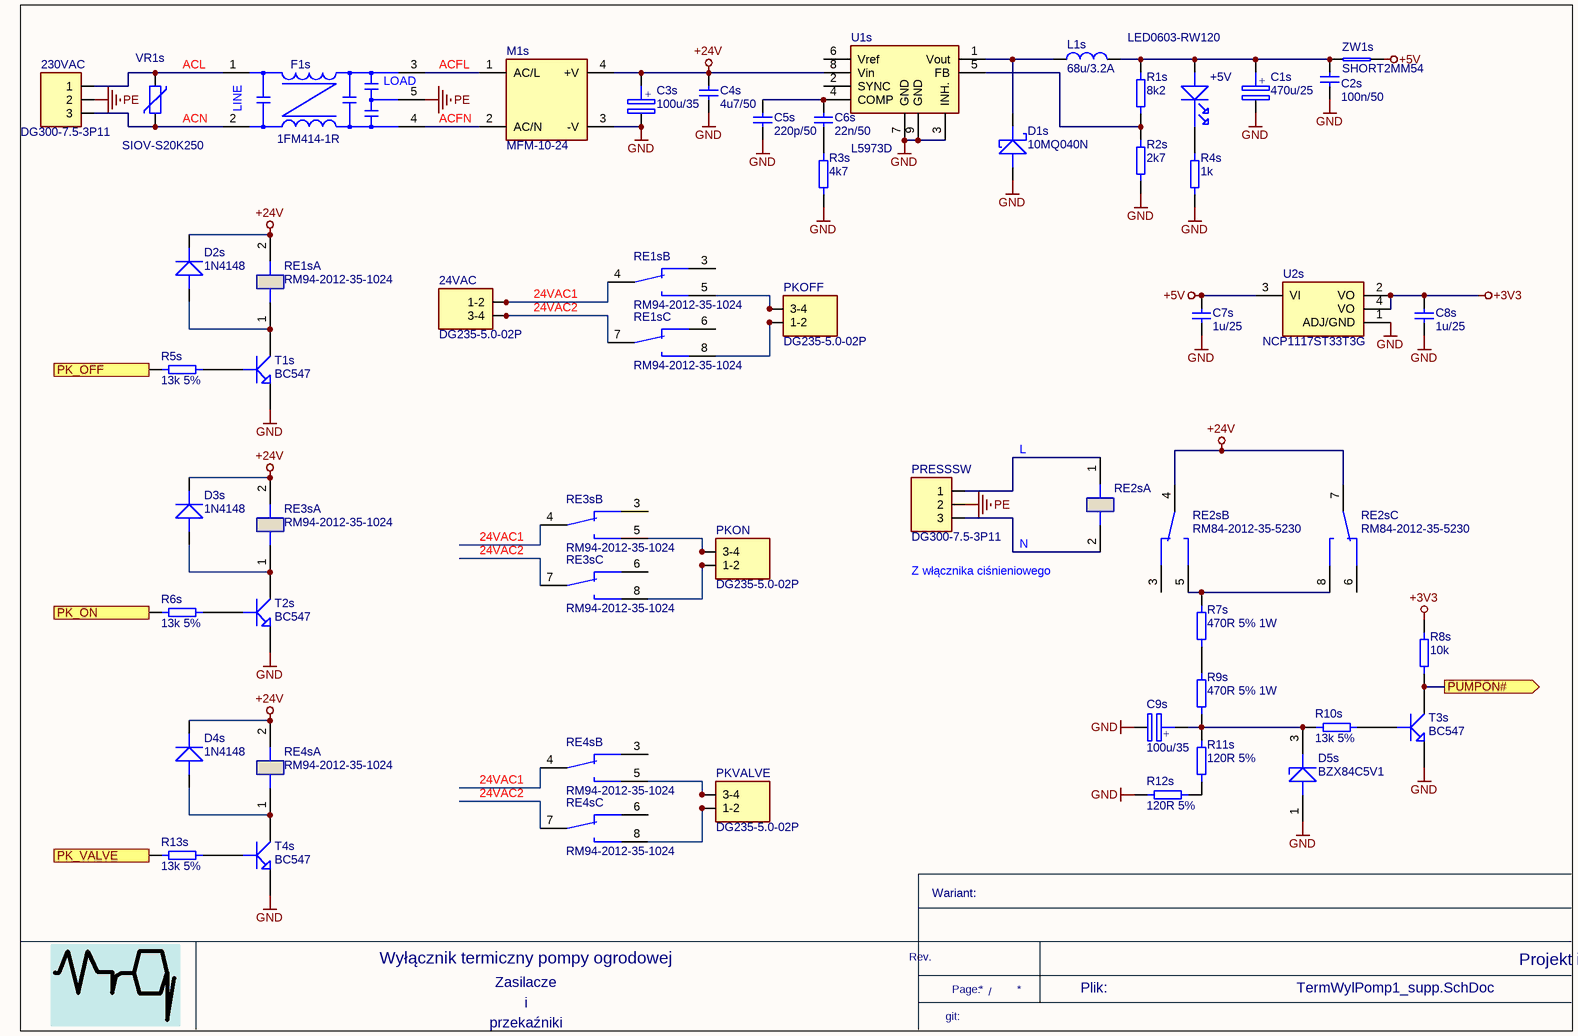
[diagram p3: TermWylPomp1_supp.SchDoc]

### Parts
24VAC  DG235-5.0-02P  [DG235-5.0-02P]
230VAC  DG300-7.5-3P11  [DG300-7.5-3P11]
+5V  LED0603-RW120  [D0603]
C1s  470u/25  [CE2040]
C2s  100n/50  [0805]
C3s  100u/35  [CE1028]
C4s  4u7/50  [1210]
C5s  220p/50  [0603-IPC]
C6s  22n/50  [0603-IPC]
C7s  1u/25  [0805]
C8s  1u/25  [0805]
C9s  100u/35  [CE1028]
D1s  10MQ040N  [SMA]
D2s  1N4148  [CE02]
D3s  1N4148  [CE02]
D4s  1N4148  [CE02]
D5s  BZX84C5V1  [SOT23-3]
F1s  1FM414-1R  [1FM414]
L1s  68u/3.2A  [SRR1208]
M1s  MFM-10-24  [MFM-10-24]
PKOFF  DG235-5.0-02P  [DG235-5.0-02P]
PKON  DG235-5.0-02P  [DG235-5.0-02P]
PKVALVE  DG235-5.0-02P  [DG235-5.0-02P]
PRESSSW  DG300-7.5-3P11  [DG300-7.5-3P11]
R1s  8k2  [0805R]
R2s  2k7  [0805R]
R3s  4k7  [0603R]
R4s  1k  [0805R]
R5s  13k 5%  [R402510]
R6s  13k 5%  [R402510]
R7s  470R 5% 1W  [R705226]
R8s  10k  [R402510]
R9s  470R 5% 1W  [R705226]
R10s  13k 5%  [R402510]
R11s  120R 5%  [R402510]
R12s  120R 5%  [R402510]
R13s  13k 5%  [R402510]
RE1s  RM94-2012-35-1024  [RM84-P]  (parts A,B,C of 3)
RE2s  RM84-2012-35-5230  [RM84-P]  (value not drawn)  (parts A,B,C of 3)
RE3s  RM94-2012-35-1024  [RM84-P]  (parts A,B,C of 3)
RE4s  RM94-2012-35-1024  [RM84-P]  (parts A,B,C of 3)
T1s  BC547  [CE35V4]
T2s  BC547  [CE35V4]
T3s  BC547  [CE35V4]
T4s  BC547  [CE35V4]
U1s  L5973D  [HSOP8]
U2s  NCP1117ST33T3G  [SOT-223]
VR1s  SIOV-S20K250  [SIOV-S20K275]
ZW1s  SHORT2MM54  [SHUNT_2MM54]

### Ports
PK_OFF (in), PK_ON (in), PK_VALVE (in), PUMPON# (out)

### Nets
+3V3: C8s.1 R8s.1 U2s.2(VO) U2s.4(VO)
+5V: C7s.1 U2s.3(VI) ZW1s.2
+24V: C3s.2 C4s.1 D2s.CATH D3s.CATH D4s.CATH M1s.4(+V) RE1s.2(A2) RE2s.4 RE2s.7 RE3s.2(A2) RE4s.2(A2) U1s.8(Vin)
GND: C1s.1 C2s.2 C3s.1 C4s.2 C5s.2 C7s.2 C8s.2 C9s.1 D1s.2(ANOD) D5s.1 M1s.3(-V) R2s.2 R3s.2 R4s.2 R12s.2 T1s.EMIT T2s.EMIT T3s.EMIT T4s.EMIT U1s.3(INH.) U1s.7(GND) U1s.9(GND) U2s.1(ADJ/GND)
PE: 230VAC.2 F1s.5 PRESSSW.2
24VAC1: 24VAC.1(1-2) 24VAC.2 RE1s.4 RE3s.4 RE4s.4
24VAC2: 24VAC.3(3-4) 24VAC.4 RE1s.7 RE3s.7 RE4s.7
ACFL: F1s.3(OUT2) M1s.1(AC/L)
ACFN: F1s.4(OUT1) M1s.2(AC/N)
ACL: 230VAC.1 F1s.1(IN1) VR1s.1
ACN: 230VAC.3 F1s.2(IN2) VR1s.2
PK_OFF: R5s.1 ; port PK_OFF
PK_ON: R6s.1 ; port PK_ON
PK_VALVE: R13s.1 ; port PK_VALVE
PUMPON#: R8s.2 T3s.COLL ; port PUMPON#
Net+5V_ANOD: +5V.ANOD C1s.2 C2s.1 L1s.2 R1s.1 ZW1s.1
Net+5V_CATH: +5V.CATH R4s.1
NetC5s_1: C5s.1 C6s.1 U1s.4(COMP)
NetC6s_2: C6s.2 R3s.1
NetC9s_2: C9s.2 D5s.3 R9s.2 R10s.1 R11s.1
NetD1s_1: D1s.1(CATH) L1s.1 U1s.1(Vout)
NetD2s_ANOD: D2s.ANOD RE1s.1(A1) T1s.COLL
NetD3s_ANOD: D3s.ANOD RE3s.1(A1) T2s.COLL
NetD4s_ANOD: D4s.ANOD RE4s.1(A1) T4s.COLL
NetPKOFF_1: PKOFF.1(1-2) PKOFF.2 RE1s.8
NetPKOFF_3: PKOFF.3(3-4) PKOFF.4 RE1s.5
NetPKON_1: PKON.1(1-2) PKON.2 RE3s.8
NetPKON_3: PKON.3(3-4) PKON.4 RE3s.5
NetPKVALVE_1: PKVALVE.1(1-2) PKVALVE.2 RE4s.8
NetPKVALVE_3: PKVALVE.3(3-4) PKVALVE.4 RE4s.5
NetPRESSSW_1: PRESSSW.1 RE2s.1(A1)
NetPRESSSW_3: PRESSSW.3 RE2s.2(A2)
NetR1s_2: R1s.2 R2s.1 U1s.5(FB)
NetR5s_2: R5s.2 T1s.BASE
NetR6s_2: R6s.2 T2s.BASE
NetR7s_1: R7s.1 RE2s.5 RE2s.8
NetR7s_2: R7s.2 R9s.1
NetR10s_2: R10s.2 T3s.BASE
NetR11s_2: R11s.2 R12s.1
NetR13s_2: R13s.2 T4s.BASE

Not connected (* = marked no-connect by the designer): RE1s 3(22) 6(12); RE2s 3(22) 6(12); RE3s 3(22) 6(12); RE4s 3(22) 6(12); U1s 2(SYNC) 6(Vref)

### Notes on the sheet
- L
- Z włącznika ciśnieniowego
- N
- Wariant:
- Rev.
- /
- Projekt i wykonanie: (C) Miroslaw Lach MRQ, www.mlach.com
- git:
- Page:
- Plik:
- (in symbol CAP15) +
- (in symbol CAP81) +
- (in symbol Ind14) LOAD; LINE

### Library data of the parts
24VAC = Con29: Kod: Con29; ID: 29; Descript: Listwa zaciskowa; kątowe 90°; 1,5mm2; tory:2; cynowany; 15A; szary; Typ5: DG235-5.0-02P-11-00A(H); Replacement: bd; Value: DG235-5.0-02P; Price5: 0; DateOfPrice5: 2010-01-01; Supplier5: tme.pl; Reference5: DG235-5.0-02P; Manufacturer5: Degson
230VAC PRESSSW = Con33: Descript: Listwa zaciskowa; kątowe 90°; 2,5mm2; 7,5mm; tory:3; cynowany; 24A; Typ5: DG300-7.5-03P-11-00A(H); Replacement: maritex: TB7503S; Kod: Con33; ID: 33; Value: DG300-7.5-3P11; Reference5: DG300-7.5-3P11; Supplier5: tme.pl; Manufacturer5: Degson; Price5: 1; DateOfPrice5: 2010-01-01
+5V = Opt25: Descript: Dioda LED, SMD 0603, Czerwona 626-636nm, 50-70 mCd /10mA, water clear, 120°; Kod: Opt25; ID: 25; Value: LED0603-RW120; Supplier5: maritex.com.pl; Reference5: LED0603-RW120; Typ5: LED0603-RW120; Price5: 0,12; DateOfPrice5: 2020-05-10; Manufacturer5: Honglitronic
C1s = CAP81: Descript: capacitor electrolythic 470uF/25V, 20%, 10x16, 5mm, low ESR; Reference5: GT470/25; Typ5: GT470u/25; Kod: CAP81; ID: 81; Value: 470u/25; Supplier5: tme.pl; Manufacturer5: Samxon; Price5: 0; DateOfPrice5: 2010-01-01
C2s = CAP7: as C1c on sheet TermWylPomp1_cpu; Value: 100n/50; Supplier5: tme.pl; Manufacturer5: Samsung; Typ5: CL21B104KBCNNNC; Price5: 0; DateOfPrice5: 2010-01-01
C3s C9s = CAP15: Descript: Kondensator: elektrolityczny; THT; 100uF; 35VDC; Ø6,3x11mm; ±20%; Reference5: SD1V107M6L011BB; Kod: CAP15; ID: 15; Value: 100u/35; Supplier5: tme.pl; Manufacturer5: SAMHA; Typ5: SD1V107M6L011BB; Price5: 0; DateOfPrice5: 2010-01-01
C4s = CAP99: Descript: Kondensator: ceramiczny; 4,7uF; 50V; X7R; ±10%; SMD; 1210; -55÷125°C; Reference5: CL32B475KBUYNNE; Kod: CAP99; ID: 99; Value: 4u7/50; Supplier5: tme.pl; Manufacturer5: Samsung; Typ5: CL32B475KBUYNNE; Price5: 2; DateOfPrice5: 2010-01-01
C5s = CAP45: Descript: Kondensator: ceramiczny; 220pF; 50V; X7R; ±10%; SMD; 0603; -55÷125°C; Reference5: CL10B221KB8NNNC; Kod: CAP45; ID: 45; Value: 220p/50; Supplier5: tme.pl; Manufacturer5: Samsung; Typ5: CL10B221KB8NNNC; Price5: 0; DateOfPrice5: 2010-01-01
C6s = CAP51: Descript: Kondensator: ceramiczny; 22nF; 50V; X7R; ±10%; SMD; 0603; -55÷125°C; Reference5: CL10B223KB8NNNC; Kod: CAP51; ID: 51; Value: 22n/50; Supplier5: tme.pl; Manufacturer5: Samsung; Typ5: CL10B223KB8NNNC; Price5: 0; DateOfPrice5: 2010-01-01
C7s C8s = CAP38: as C11c on sheet TermWylPomp1_cpu; Value: 1u/25; Supplier5: tme.pl; Manufacturer5: Samsung; Typ5: CL21B105KAFNNN; Price5: 0; DateOfPrice5: 2010-01-01
D1s = DIO1: Descript: Dioda: prostownicza Schottky; SMD; 40V; 2,1A; DO214AC; Reference5: 10MQ040NTRPBF; Typ5: VS-10MQ040NTRPBF; Kod: DIO1; ID: 1; Value: 10MQ040N; Supplier5: tme.pl; Manufacturer5: Vishay; Price5: 0; DateOfPrice5: 2010-01-01
D2s D3s D4s = DIO2: Kod: DIO2; ID: 2; Descript: Dioda: przełączająca; 100V; 300mA; 2A; DO35; Reference5: 1N4148-TAP; Value: 1N4148; Price5: 0; DateOfPrice5: 2010-01-01; Supplier5: tme.pl; Manufacturer5: Vishay; Typ5: 1N4148-TAP
D5s = DIO13: Descript: Zener diode 5.1V, 0.3W, SOT-23; Typ5: BZX84-C5V1.215; Kod: DIO13; ID: 13; Value: BZX84C5V1; Reference5: BZX84C5V1; Supplier5: tme.pl; Manufacturer5: NXP; Price5: 0; DateOfPrice5: 2010-01-01
F1s = Ind14: Descript: Radio filter 250VAC, 1A; Kod: Ind14; ID: 14; Value: 1FM414-1R; Reference5: 1FM414-1R; Supplier5: tme.pl; Manufacturer5: FilterCon; Price5: 15; DateOfPrice5: 2010-01-01; InductCurr: -; Typ5: -
L1s = Ind37: Descript: 7447709680 - Cewka mocy do montażu powierzchniowego, Seria WE-PD, 68 µH, 3.2 A, 3.6 A, Osłonięte, 0.089 ohm; Reference5: 1635947; Typ5: 7447709680; Kod: Ind37; ID: 37; InductCurr: 3,2A; Value: 68u/3.2A; DateOfPrice5: 2010-01-01; Manufacturer5: Wuerth; Price5: 10; Supplier5: farnell.com
M1s = Mod92: Kod: Mod92; ID: 92; Descript: Zasilacz: impulsowy; 10W; 80÷264VAC; Wyjścia: 1; 420mA; -30÷85°C; Value: MFM-10-24; Price5: 33; DateOfPrice5: 2010-01-01; Supplier5: tme.pl; Reference5: MFM-10-24; Manufacturer5: MeanWell; Typ5: MFM-10-24
PKOFF PKON PKVALVE = Con29: Descript: Listwa zaciskowa; kątowe 90°; 1,5mm2; tory:2; cynowany; 15A; szary; Typ5: DG235-5.0-02P-11-00A(H); Replacement: bd; Kod: Con29; ID: 29; Value: DG235-5.0-02P; Reference5: DG235-5.0-02P; Supplier5: tme.pl; Manufacturer5: Degson; Price5: 0; DateOfPrice5: 2010-01-01
R1s = Res233: Descript: Rezystor: thick film; SMD; 0805; 8,2kΩ; 0,125W; ±1%; -55÷125°C; Reference5: SMD0805-8K2-1%; Typ5: 0805S8F8201T5E; Kod: Res233; ID: 233; Value: 8k2; Supplier5: tme.pl; Manufacturer5: Royal Ohm; Price5: 0,1; DateOfPrice5: 2020-06-25 12:16:54
R2s = Res115: Descript: Rezystor: thick film; SMD; 0805; 2,7kΩ; 0,125W; ±1%; -55÷125°C; Reference5: SMD0805-2K7-1%; Typ5: 0805S8F2701T5E; Kod: Res115; ID: 115; Value: 2k7; Supplier5: tme.pl; Manufacturer5: Royal Ohm; Price5: 0,1; DateOfPrice5: 2020-06-25 12:16:54
R3s = Res171: Descript: Rezystor: thick film; SMD; 0603; 4,7kom; 0,1W; ±1%; -55÷125°C; Reference5: SMD0603-4K7-1%; Typ5: 0603SAF4701T5E; Kod: Res171; ID: 171; Value: 4k7; Supplier5: tme.pl; Manufacturer5: Royal Ohm; Price5: 0,1; DateOfPrice5: 2020-06-25 12:16:54
R4s = Res53: Descript: Rezystor: thick film; SMD; 0805; 1kom; 0,125W; ±1%; -55÷125°C; Reference5: SMD0805-1K-1%; Typ5: 0805WAF 1K T5E; Kod: Res53; ID: 53; Value: 1k; Supplier5: tme.pl; Manufacturer5: Royal Ohm; Price5: 0,1; DateOfPrice5: 2020-06-25 12:16:54
R5s R6s R10s R13s = Res66: as R3c on sheet TermWylPomp1_cpu; Value: 13k 5%; Supplier5: mrq; Manufacturer5: Royal Ohm; Price5: 0,06; DateOfPrice5: 2020-07-26 12:26:58
R7s R9s = Res63: Descript: ML1W-470R-5% Rezystor metalizowany THT 470om; 1W; ±5%; O5,5x13mm; Reference5: ML1W-470R-5%; Kod: Res63; ID: 63; Value: 470R 5% 1W; Supplier5: mrq; Manufacturer5: -; Price5: 0,1; Typ5: -; DateOfPrice5: 2020-08-01 09:57:11
R8s = Res17: Descript: Rezystor: metal film; THT; 10kΩ; 0,6W; ±1%; Ø2,5x6,8mm; 50ppm/°C; Reference5: M0.6W-10K; Typ5: MF006FF1002A50; Kod: Res17; ID: 17; Value: 10k; Supplier5: tme.pl; Manufacturer5: Royal Ohm; Price5: 0,1; DateOfPrice5: 2020-06-25 12:16:54
R11s R12s = Res32: Descript: Rezystor: węglowy; THT; 120Ω; 0,25W; ±5%; Ø2,5x6,8mm; osiowe; Reference5: 1/4W120R; Typ5: CFR0W4J0121A50; Kod: Res32; ID: 32; Value: 120R 5%; Supplier5: tme; Manufacturer5: Royal Ohm; Price5: 0,1; DateOfPrice5: 2020-08-01 06:36:55
RE1s RE3s RE4s = Rel24: Descript: Przekaźnik: elektromagnetyczny; DPDT; Ucewki : 24VDC; 8A/250VAC, nie produkowany; Kod: Rel24; ID: 24; Value: RM94-2012-35-1024; Supplier5: -; Reference5: RM94-2012-35-1024; Manufacturer5: Relpol; Typ5: RM94-2012-35-1024; Price5: 5; DateOfPrice5: 2020-07-19 19:16:04
RE2s = Rel15: Descript: Przekaźnik: elektromagnetyczny; DPDT; Ucewki: 230VAC; 8A/250VAC; Reference5: RM84-P-230VAC; Kod: Rel15; ID: 15; Value: RM84-2012-35-5230; Supplier5: tme.pl; Manufacturer5: Relpol; Typ5: RM84-2012-35-5230; Price5: 15; DateOfPrice5: 2010-01-01
T1s T2s T3s T4s = Tra9: as T2c on sheet TermWylPomp1_cpu; Value: BC547; Supplier5: tme.pl; Manufacturer5: Diotec; Price5: 0,1; Typ5: BC547A; DateOfPrice5: 2010-01-01
U1s = ICs119: Descript: Driver; przetwornica DC/DC; 2,5A; 1,2÷35V; 2,25W; Kanały: 1; 250kHz; Kod: ICs119; ID: 119; Value: L5973D; Supplier5: tme.pl; Reference5: L5973D; Manufacturer5: ST; Typ5: L5973D; Price5: 10; DateOfPrice5: 2010-01-01
U2s = ICs176: Descript: Stabilizator napięcia; LDO, liniowy, nieregulowany; 3,3V; 1A; SMD; Kod: ICs176; ID: 176; Value: NCP1117ST33T3G; Supplier5: tme; Reference5: NCP1117ST33T3G; Manufacturer5: ON Semiconductor; Typ5: NCP1117ST33T3G; Price5: 0; DateOfPrice5: 2010-01-01
VR1s = Vre35: Descript: Warystor: metalowo-tlenkowy; THT; 250VAC; 320VDC; 390V; 8000A; 140J; Kod: Vre35; ID: 35; Value: SIOV-S20K250; Reference5: SIOV-S20K250; Supplier5: tme.pl; Manufacturer5: Epcos; Price5: 2,6; Typ5: S20K250; DateOfPrice5: 2020-06-03
ZW1s = Res74: Kod: Res74; ID: 74; Descript: Przewlekana zwora z drutu o rozstawie 2.54mm; Value: SHORT2MM54; Price5: 0,1; Manufacturer5: -; Reference5: -; Supplier5: -; Typ5: -; DateOfPrice5: 2020-08-11 22:24:50

## Sheet TermWylPomp1_rf.SchDoc
size A4; LotOfPieces: 1
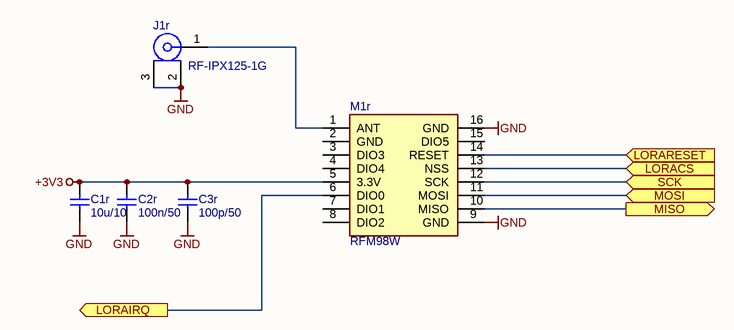
[diagram p4: TermWylPomp1_rf.SchDoc]

### Parts
C1r  10u/10  [0805]
C2r  100n/50  [0603-IPC]
C3r  100p/50  [0603-IPC]
J1r  RF-IPX125-1G  [HIROSE-UFL]
M1r  RFM98W  [RFM98W]

### Ports
LORACS (in), LORAIRQ (out), LORARESET (in), MISO (out), MOSI (in), SCK (in)

### Nets
+3V3: C1r.1 C2r.1 C3r.1 M1r.5(3.3V)
GND: C1r.2 C2r.2 C3r.2 J1r.2 J1r.3 M1r.9(GND) M1r.16(GND)
LORACS: M1r.13(NSS) ; port LORACS
LORAIRQ: M1r.6(DIO0) ; port LORAIRQ
LORARESET: M1r.14(RESET) ; port LORARESET
MISO: M1r.10(MISO) ; port MISO
MOSI: M1r.11(MOSI) ; port MOSI
SCK: M1r.12(SCK) ; port SCK
NetJ1r_1: J1r.1 M1r.1(ANT)

Not connected (* = marked no-connect by the designer): M1r 2(GND) 3(DIO3) 4(DIO4) 7(DIO1) 8(DIO2) 15(DIO5)

### Notes on the sheet
- Wariant:
- Rev.
- /
- Projekt i wykonanie: (C) Miroslaw Lach MRQ, www.mlach.com
- git:
- Page:
- Plik:

### Library data of the parts
C1r = CAP25: Descript: Kondensator: ceramiczny; MLCC; 10uF; 10V; X7R; ±10%; SMD; 0805; Reference5: CL21B106KPQNNNG; Kod: CAP25; ID: 25; Value: 10u/10; Supplier5: tme.pl; Manufacturer5: Samsung; Typ5: CL21B106KPQNNNG; Price5: 0; DateOfPrice5: 2010-01-01
C2r = CAP6: Descript: Kondensator: ceramiczny; MLCC; 100nF; 50V; X7R; ±5%; SMD; 0603; Reference5: CL10B104JB8NNNC; Kod: CAP6; ID: 6; Value: 100n/50; Supplier5: tme.pl; Manufacturer5: Samsung; Typ5: CL10B104JB8NNNC; Price5: 0,25; DateOfPrice5: 2020-05-10
C3r = CAP10: Descript: capacitor 100pF,50V, 0603, COG, 5%; Reference5: CL10C101JB8NNNC; Kod: CAP10; ID: 10; Value: 100p/50; Supplier5: tme.pl; Manufacturer5: Samsung; Typ5: CL10C101JB8NNNC; Price5: 0; DateOfPrice5: 2010-01-01
J1r = Con210: Descript: Miniaturowe 1G, męskie gniazdo RF, antenowe, o wysokość 1.25mm, 1 generacji, obudowa srebrzona, kontakt złocony, 0-6 GHz, do montażu SMT; Reference5: RF-IPX125-1G-AG; Kod: Con210; ID: 210; Replacement: bd; Value: RF-IPX125-1G; Supplier5: maritex.com.pl; Price5: 1; DateOfPrice5: 2010-01-01; Manufacturer5: Hirose
M1r = Mod57: Descript: Moduł: RF; transceiver FM; FSK, GFSK, GMSK, LoRa, MSK, OOK; 433,92MHz; Reference5: RFM98W-433S2; Kod: Mod57; ID: 57; Value: RFM98W; Supplier5: tme.pl; Typ5: RFM98W-433S2; Price5: 39; DateOfPrice5: 2010-01-01; Manufacturer5: Hope

## Nets that join several sheets
+3V3: TermWylPomp1_cpu (21 pins), TermWylPomp1_ds18 (R1d.1 R5d.1 R9d.1), TermWylPomp1_supp (C8s.1 R8s.1 U2s.2 U2s.4), TermWylPomp1_rf (C1r.1 C2r.1 C3r.1 M1r.5)
+5V: TermWylPomp1_cpu (DIS1c.15 J1c.1 J2c.1), TermWylPomp1_ds18 (9 pins), TermWylPomp1_supp (C7s.1 U2s.3 ZW1s.2)
GND: TermWylPomp1_cpu (59 pins), TermWylPomp1_ds18 (15 pins), TermWylPomp1_supp (23 pins), TermWylPomp1_rf (7 pins)
DSDATAIN0: TermWylPomp1_cpu (U1c.15), TermWylPomp1_ds18 (R1d.2 T1d.3)
DSDATAIN1: TermWylPomp1_cpu (U1c.9), TermWylPomp1_ds18 (R5d.2 T3d.3)
DSDATAIN2: TermWylPomp1_cpu (U1c.51), TermWylPomp1_ds18 (R9d.2 T5d.3)
DSDATAOUT0: TermWylPomp1_cpu (U1c.8), TermWylPomp1_ds18 (R4d.1)
DSDATAOUT1: TermWylPomp1_cpu (U1c.10), TermWylPomp1_ds18 (R8d.1)
DSDATAOUT2: TermWylPomp1_cpu (U1c.52), TermWylPomp1_ds18 (R12d.1)
LORACS: TermWylPomp1_cpu (U1c.20), TermWylPomp1_rf (M1r.13)
LORAIRQ: TermWylPomp1_cpu (U1c.41), TermWylPomp1_rf (M1r.6)
LORARESET: TermWylPomp1_cpu (U1c.44), TermWylPomp1_rf (M1r.14)
MISO: TermWylPomp1_cpu (U1c.22 U4c.2), TermWylPomp1_rf (M1r.10)
MOSI: TermWylPomp1_cpu (U1c.23 U4c.5), TermWylPomp1_rf (M1r.11)
PK_OFF: TermWylPomp1_cpu (U1c.40), TermWylPomp1_supp (R5s.1)
PK_ON: TermWylPomp1_cpu (U1c.45), TermWylPomp1_supp (R6s.1)
PK_VALVE: TermWylPomp1_cpu (U1c.11), TermWylPomp1_supp (R13s.1)
PUMPON#: TermWylPomp1_cpu (U1c.37), TermWylPomp1_supp (R8s.2 T3s.COLL)
SCK: TermWylPomp1_cpu (U1c.21 U4c.6), TermWylPomp1_rf (M1r.12)